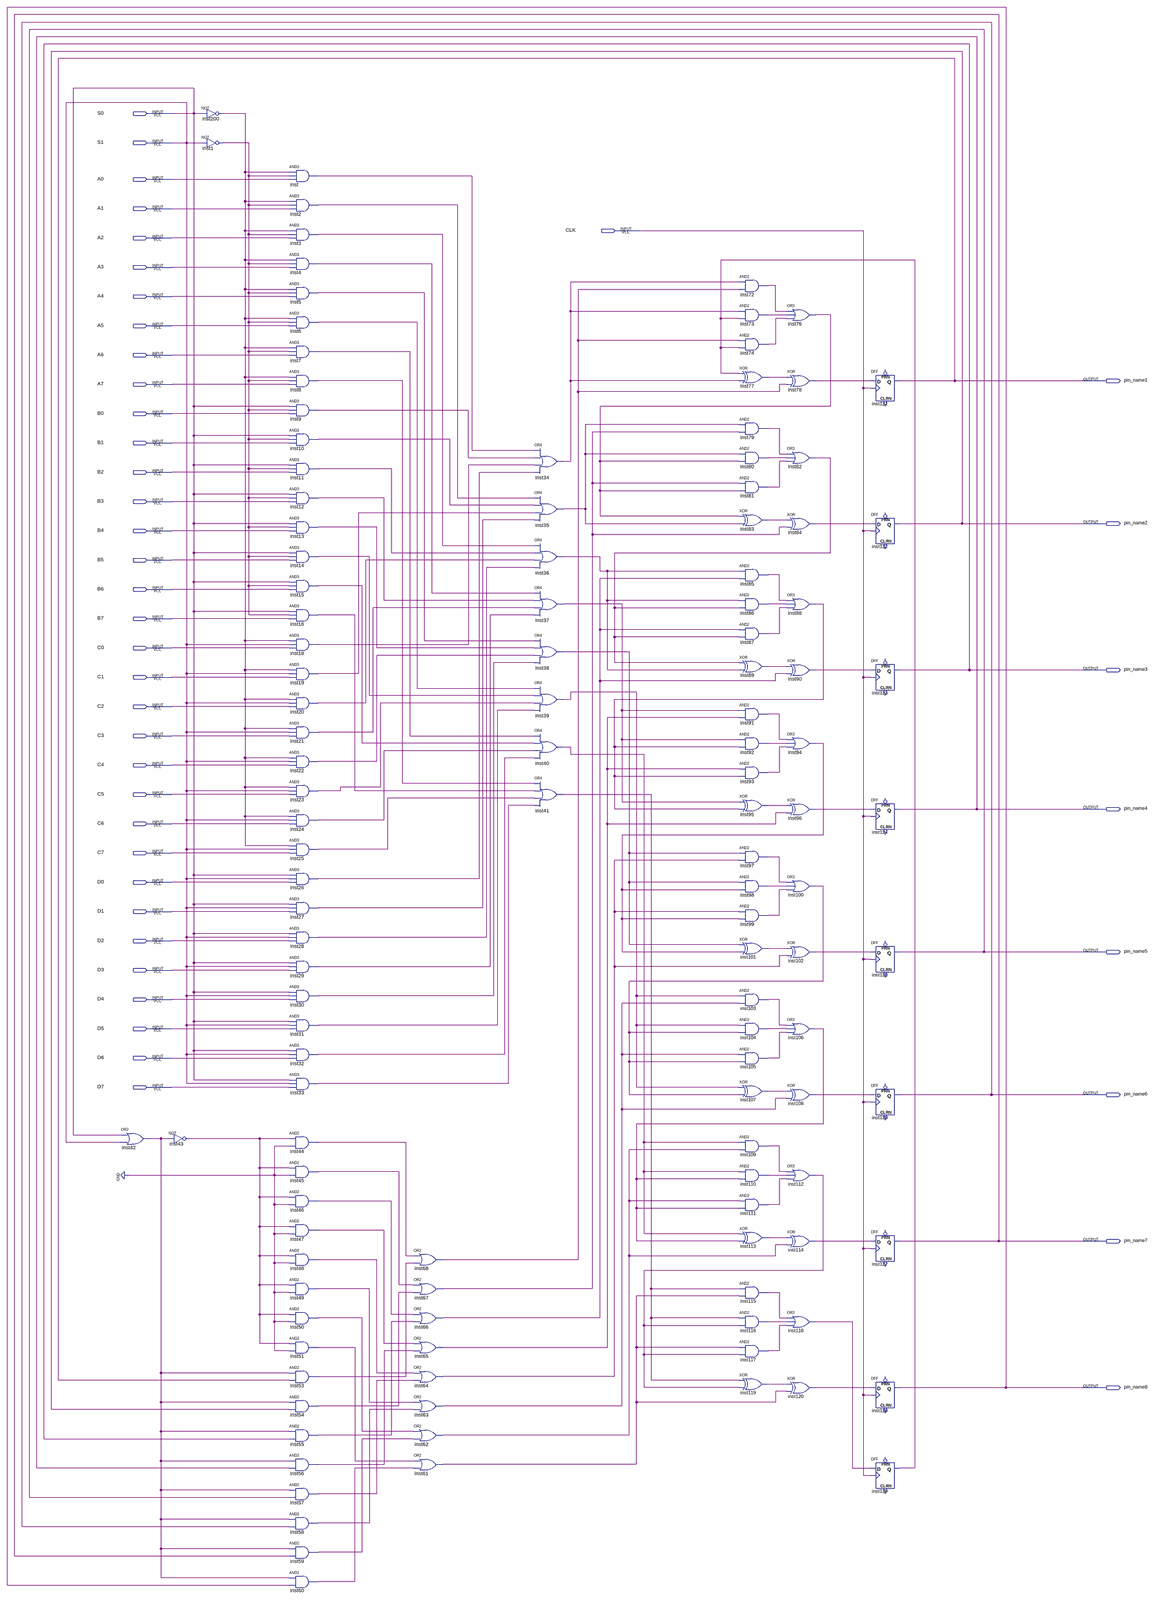
[diagram p0: schematic sheet, whole]
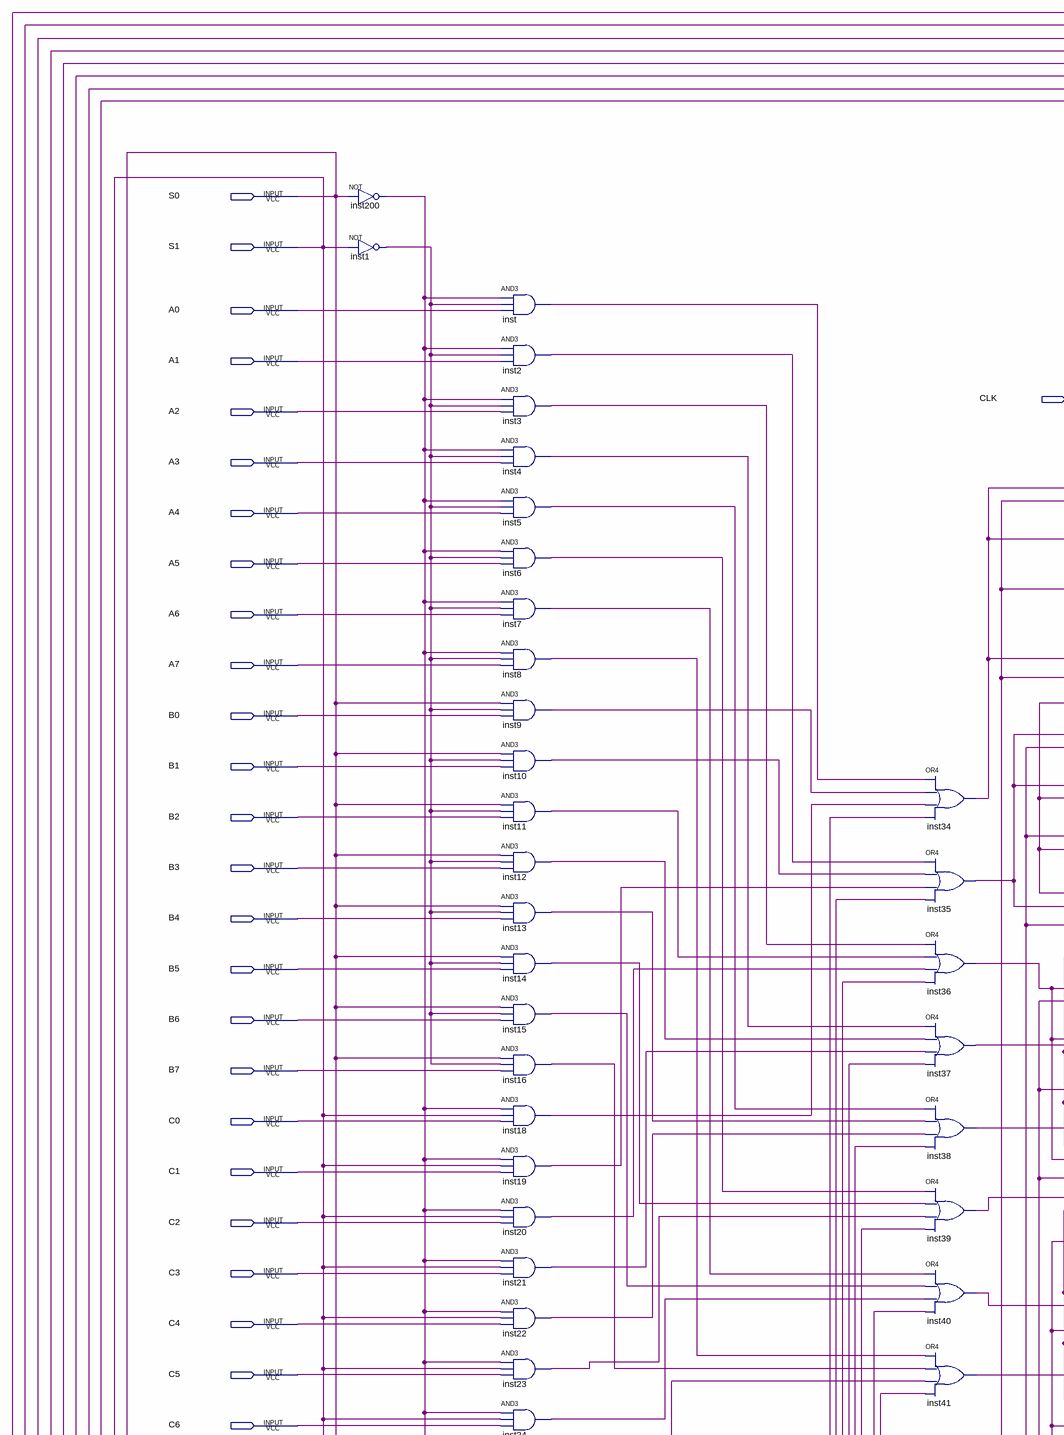
[diagram p1: schematic sheet, upper left part]
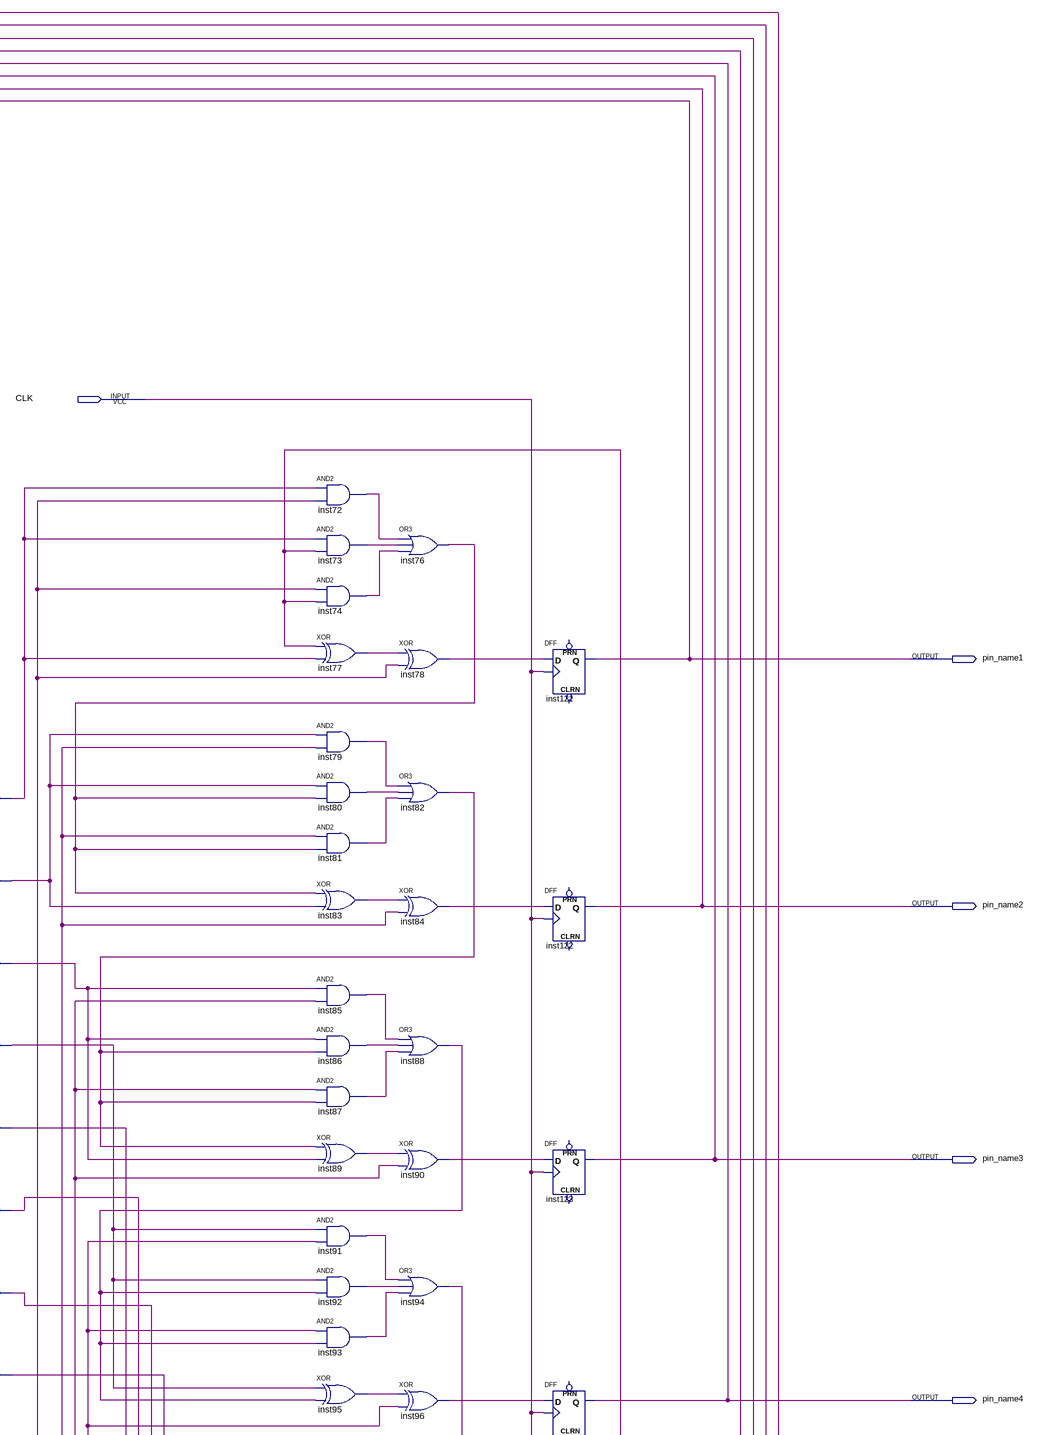
[diagram p2: schematic sheet, upper right part]
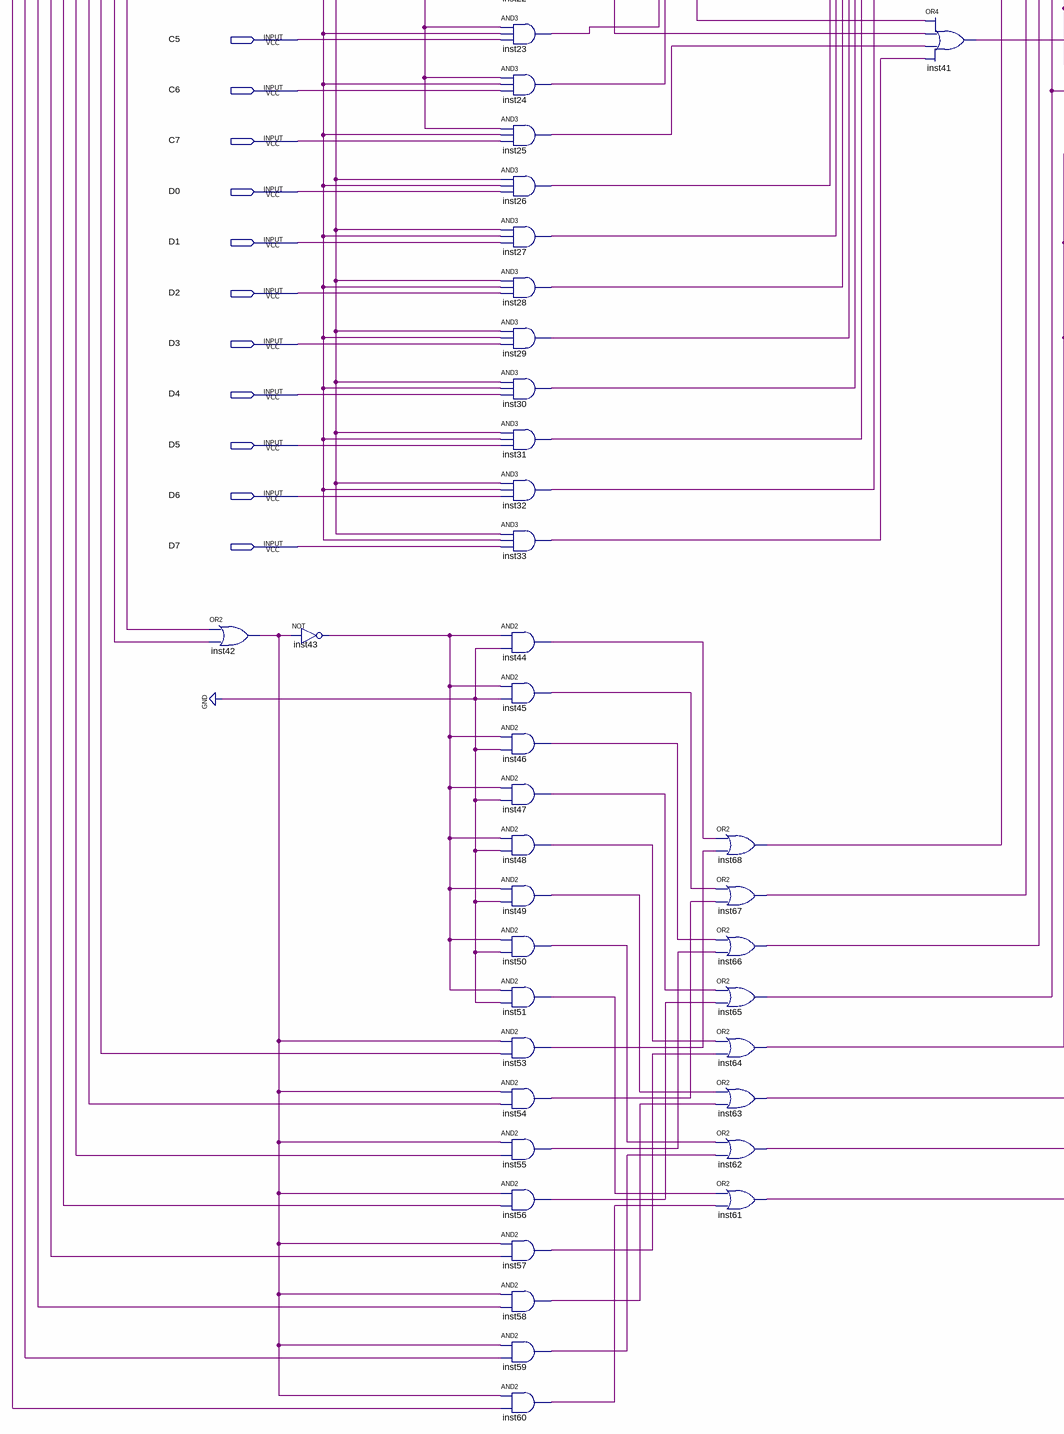
[diagram p3: schematic sheet, lower left part]
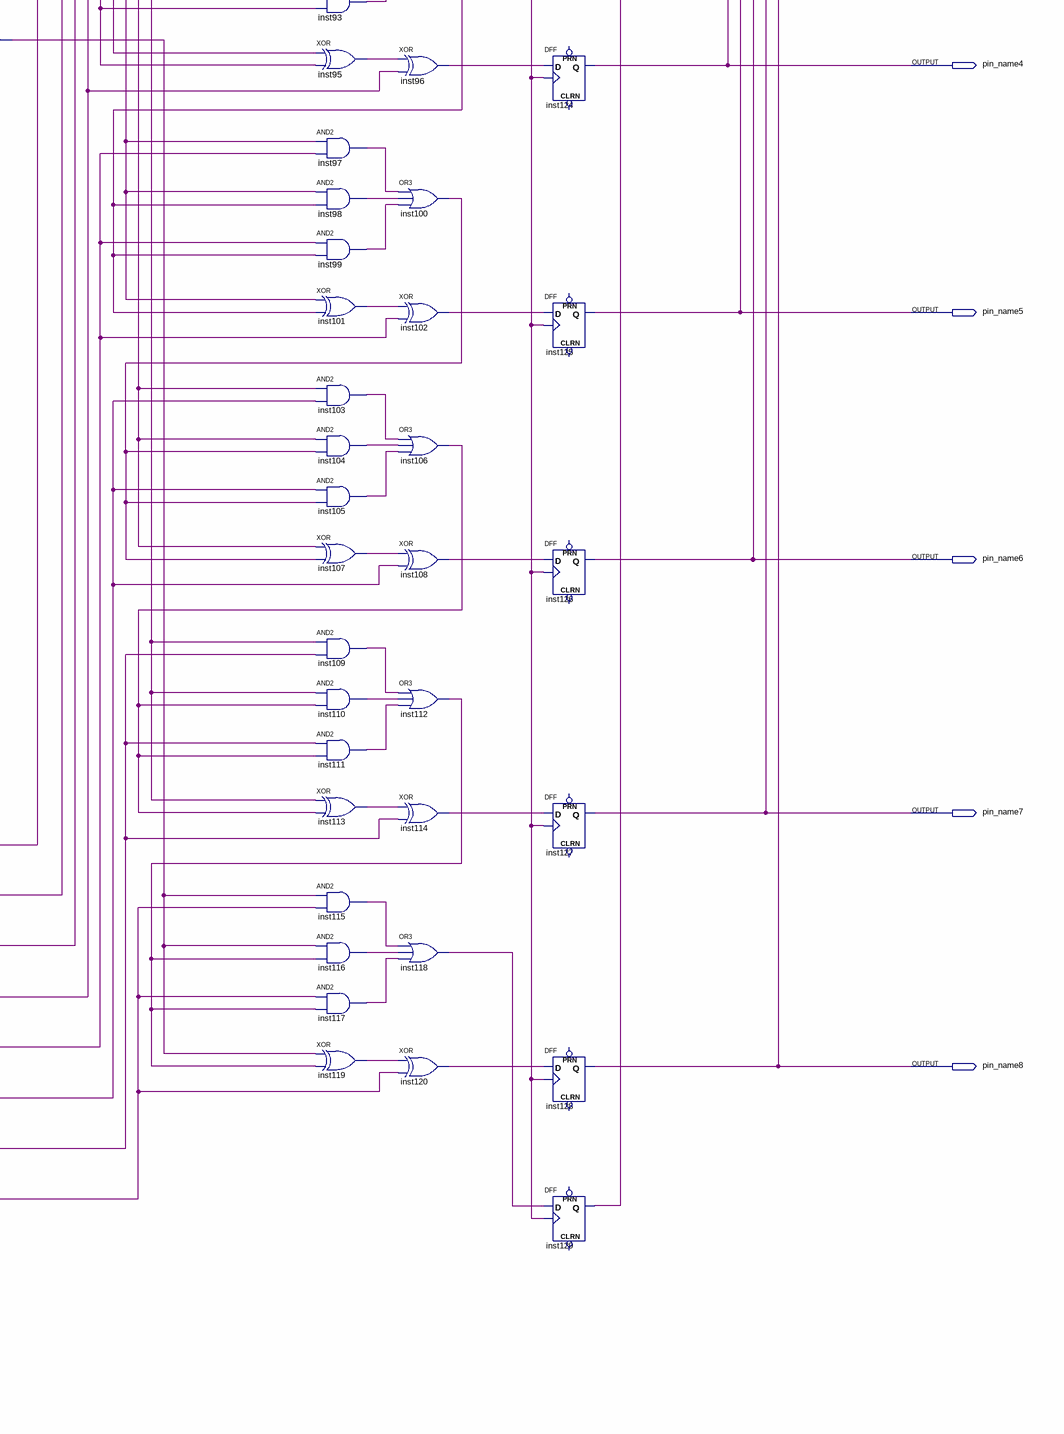
[diagram p4: schematic sheet, lower right part]
// Quartus schematic lab06.bdf as structural Verilog: 125 symbols, 43 pins
module lab06 (
  input  S0,
  input  S1,
  input  A0,
  input  A1,
  input  CLK,
  input  A2,
  input  A3,
  input  A4,
  input  A5,
  input  A6,
  input  A7,
  input  B0,
  input  B1,
  input  B2,
  input  B3,
  input  B4,
  input  B5,
  input  B6,
  input  B7,
  input  C0,
  input  C1,
  input  C2,
  input  C3,
  input  C4,
  input  C5,
  input  C6,
  input  C7,
  input  D0,
  input  D1,
  input  D2,
  input  D3,
  input  D4,
  input  D5,
  input  D6,
  input  D7,
  output pin_name1,
  output pin_name2,
  output pin_name3,
  output pin_name4,
  output pin_name5,
  output pin_name6,
  output pin_name7,
  output pin_name8
);

  wire inst1_out, inst2_out, inst3_out, inst4_out, inst5_out, inst6_out, inst7_out, inst8_out, inst9_out,
       inst10_out, inst11_out, inst12_out, inst13_out, inst14_out, inst15_out, inst16_out, inst18_out,
       inst19_out, inst20_out, inst21_out, inst22_out, inst23_out, inst24_out, inst25_out, inst26_out,
       inst27_out, inst28_out, inst29_out, inst30_out, inst31_out, inst32_out, inst33_out, inst34_out,
       inst35_out, inst36_out, inst37_out, inst38_out, inst39_out, inst40_out, inst41_out, inst42_out,
       inst43_out, inst44_out, inst45_out, inst46_out, inst47_out, inst48_out, inst49_out, inst50_out,
       inst51_out, inst53_out, inst54_out, inst55_out, inst56_out, inst57_out, inst58_out, inst59_out,
       inst60_out, inst61_out, inst62_out, inst63_out, inst64_out, inst65_out, inst66_out, inst67_out,
       inst68_out, inst72_out, inst73_out, inst74_out, inst76_out, inst77_out, inst78_out, inst79_out,
       inst80_out, inst81_out, inst82_out, inst83_out, inst84_out, inst85_out, inst86_out, inst87_out,
       inst88_out, inst89_out, inst90_out, inst91_out, inst92_out, inst93_out, inst94_out, inst95_out,
       inst96_out, inst97_out, inst98_out, inst99_out, inst100_out, inst101_out, inst102_out, inst103_out,
       inst104_out, inst105_out, inst106_out, inst107_out, inst108_out, inst109_out, inst110_out,
       inst111_out, inst112_out, inst113_out, inst114_out, inst115_out, inst116_out, inst117_out,
       inst118_out, inst119_out, inst120_out, inst129_q, inst200_out, inst_out;

  or inst42 (inst42_out, S0, S1);
  not inst43 (inst43_out, inst42_out);
  not inst200 (inst200_out, S0);
  not inst1 (inst1_out, S1);
  and inst (inst_out, inst200_out, inst1_out, A0);
  and inst2 (inst2_out, inst200_out, inst1_out, A1);
  and inst3 (inst3_out, inst200_out, inst1_out, A2);
  and inst4 (inst4_out, inst200_out, inst1_out, A3);
  and inst5 (inst5_out, inst200_out, inst1_out, A4);
  and inst6 (inst6_out, inst200_out, inst1_out, A5);
  and inst7 (inst7_out, inst200_out, inst1_out, A6);
  and inst8 (inst8_out, inst200_out, inst1_out, A7);
  and inst9 (inst9_out, S0, inst1_out, B0);
  and inst10 (inst10_out, S0, inst1_out, B1);
  and inst11 (inst11_out, S0, inst1_out, B2);
  and inst12 (inst12_out, S0, inst1_out, B3);
  and inst13 (inst13_out, S0, inst1_out, B4);
  and inst14 (inst14_out, S0, inst1_out, B5);
  and inst15 (inst15_out, S0, inst1_out, B6);
  and inst16 (inst16_out, S0, inst1_out, B7);
  and inst18 (inst18_out, inst200_out, S1, C0);
  and inst19 (inst19_out, inst200_out, S1, C1);
  and inst20 (inst20_out, inst200_out, S1, C2);
  and inst21 (inst21_out, inst200_out, S1, C3);
  and inst22 (inst22_out, inst200_out, S1, C4);
  and inst23 (inst23_out, inst200_out, S1, C5);
  and inst24 (inst24_out, inst200_out, S1, C6);
  and inst25 (inst25_out, inst200_out, S1, C7);
  and inst26 (inst26_out, S0, S1, D0);
  and inst27 (inst27_out, S0, S1, D1);
  and inst28 (inst28_out, S0, S1, D2);
  and inst29 (inst29_out, S0, S1, D3);
  and inst30 (inst30_out, S0, S1, D4);
  and inst31 (inst31_out, S0, S1, D5);
  and inst32 (inst32_out, S0, S1, D6);
  and inst33 (inst33_out, S0, S1, D7);
  and inst44 (inst44_out, inst43_out, 1'b0);
  and inst45 (inst45_out, inst43_out, 1'b0);
  and inst46 (inst46_out, inst43_out, 1'b0);
  and inst47 (inst47_out, inst43_out, 1'b0);
  and inst48 (inst48_out, inst43_out, 1'b0);
  and inst49 (inst49_out, inst43_out, 1'b0);
  and inst50 (inst50_out, inst43_out, 1'b0);
  and inst51 (inst51_out, inst43_out, 1'b0);
  and inst53 (inst53_out, inst42_out, pin_name1);
  and inst54 (inst54_out, inst42_out, pin_name2);
  and inst55 (inst55_out, inst42_out, pin_name3);
  and inst56 (inst56_out, inst42_out, pin_name4);
  and inst57 (inst57_out, inst42_out, pin_name5);
  and inst58 (inst58_out, inst42_out, pin_name6);
  and inst59 (inst59_out, inst42_out, pin_name7);
  and inst60 (inst60_out, inst42_out, pin_name8);
  or inst68 (inst68_out, inst44_out, inst53_out);
  or inst67 (inst67_out, inst45_out, inst54_out);
  or inst66 (inst66_out, inst46_out, inst55_out);
  or inst65 (inst65_out, inst47_out, inst56_out);
  or inst64 (inst64_out, inst48_out, inst57_out);
  or inst63 (inst63_out, inst49_out, inst58_out);
  or inst62 (inst62_out, inst50_out, inst59_out);
  or inst61 (inst61_out, inst51_out, inst60_out);
  or inst34 (inst34_out, inst_out, inst9_out, inst18_out, inst26_out);
  or inst35 (inst35_out, inst2_out, inst10_out, inst19_out, inst27_out);
  or inst36 (inst36_out, inst3_out, inst11_out, inst20_out, inst28_out);
  or inst37 (inst37_out, inst4_out, inst12_out, inst21_out, inst29_out);
  or inst38 (inst38_out, inst5_out, inst13_out, inst22_out, inst30_out);
  or inst39 (inst39_out, inst6_out, inst14_out, inst23_out, inst31_out);
  or inst40 (inst40_out, inst7_out, inst15_out, inst24_out, inst32_out);
  or inst41 (inst41_out, inst8_out, inst16_out, inst25_out, inst33_out);
  and inst72 (inst72_out, inst34_out, inst68_out);
  and inst73 (inst73_out, inst34_out, inst129_q);
  and inst74 (inst74_out, inst68_out, inst129_q);
  xor inst77 (inst77_out, inst129_q, inst34_out);
  and inst79 (inst79_out, inst35_out, inst67_out);
  and inst80 (inst80_out, inst35_out, inst76_out);
  and inst81 (inst81_out, inst67_out, inst76_out);
  xor inst83 (inst83_out, inst76_out, inst35_out);
  and inst85 (inst85_out, inst36_out, inst66_out);
  and inst86 (inst86_out, inst36_out, inst82_out);
  and inst87 (inst87_out, inst66_out, inst82_out);
  xor inst89 (inst89_out, inst82_out, inst36_out);
  and inst91 (inst91_out, inst37_out, inst65_out);
  and inst92 (inst92_out, inst37_out, inst88_out);
  and inst93 (inst93_out, inst65_out, inst88_out);
  xor inst95 (inst95_out, inst37_out, inst88_out);
  and inst97 (inst97_out, inst38_out, inst64_out);
  and inst98 (inst98_out, inst38_out, inst94_out);
  and inst99 (inst99_out, inst64_out, inst94_out);
  xor inst101 (inst101_out, inst38_out, inst94_out);
  and inst103 (inst103_out, inst39_out, inst63_out);
  and inst104 (inst104_out, inst39_out, inst100_out);
  and inst105 (inst105_out, inst63_out, inst100_out);
  xor inst107 (inst107_out, inst39_out, inst100_out);
  and inst109 (inst109_out, inst40_out, inst62_out);
  and inst110 (inst110_out, inst40_out, inst106_out);
  and inst111 (inst111_out, inst62_out, inst106_out);
  xor inst113 (inst113_out, inst40_out, inst106_out);
  and inst115 (inst115_out, inst41_out, inst61_out);
  and inst116 (inst116_out, inst41_out, inst112_out);
  and inst117 (inst117_out, inst61_out, inst112_out);
  xor inst119 (inst119_out, inst41_out, inst112_out);
  or inst76 (inst76_out, inst72_out, inst73_out, inst74_out);
  xor inst78 (inst78_out, inst77_out, inst68_out);
  or inst82 (inst82_out, inst79_out, inst80_out, inst81_out);
  xor inst84 (inst84_out, inst83_out, inst67_out);
  or inst88 (inst88_out, inst85_out, inst86_out, inst87_out);
  xor inst90 (inst90_out, inst89_out, inst66_out);
  or inst94 (inst94_out, inst91_out, inst92_out, inst93_out);
  xor inst96 (inst96_out, inst95_out, inst65_out);
  or inst100 (inst100_out, inst97_out, inst98_out, inst99_out);
  xor inst102 (inst102_out, inst101_out, inst64_out);
  or inst106 (inst106_out, inst103_out, inst104_out, inst105_out);
  xor inst108 (inst108_out, inst107_out, inst63_out);
  or inst112 (inst112_out, inst109_out, inst110_out, inst111_out);
  xor inst114 (inst114_out, inst113_out, inst62_out);
  or inst118 (inst118_out, inst115_out, inst116_out, inst117_out);
  xor inst120 (inst120_out, inst119_out, inst61_out);
  DFF inst121 (.CLK(CLK), .D(inst78_out), .Q(pin_name1));  // open: CLRN, PRN
  DFF inst122 (.CLK(CLK), .D(inst84_out), .Q(pin_name2));  // open: CLRN, PRN
  DFF inst123 (.CLK(CLK), .D(inst90_out), .Q(pin_name3));  // open: CLRN, PRN
  DFF inst124 (.CLK(CLK), .D(inst96_out), .Q(pin_name4));  // open: CLRN, PRN
  DFF inst125 (.CLK(CLK), .D(inst102_out), .Q(pin_name5));  // open: CLRN, PRN
  DFF inst126 (.CLK(CLK), .D(inst108_out), .Q(pin_name6));  // open: CLRN, PRN
  DFF inst127 (.CLK(CLK), .D(inst114_out), .Q(pin_name7));  // open: CLRN, PRN
  DFF inst128 (.CLK(CLK), .D(inst120_out), .Q(pin_name8));  // open: CLRN, PRN
  DFF inst129 (.CLK(CLK), .D(inst118_out), .Q(inst129_q));  // open: CLRN, PRN
endmodule
